# EAGLE design luxeon_r2 (EAGLE 5.08)
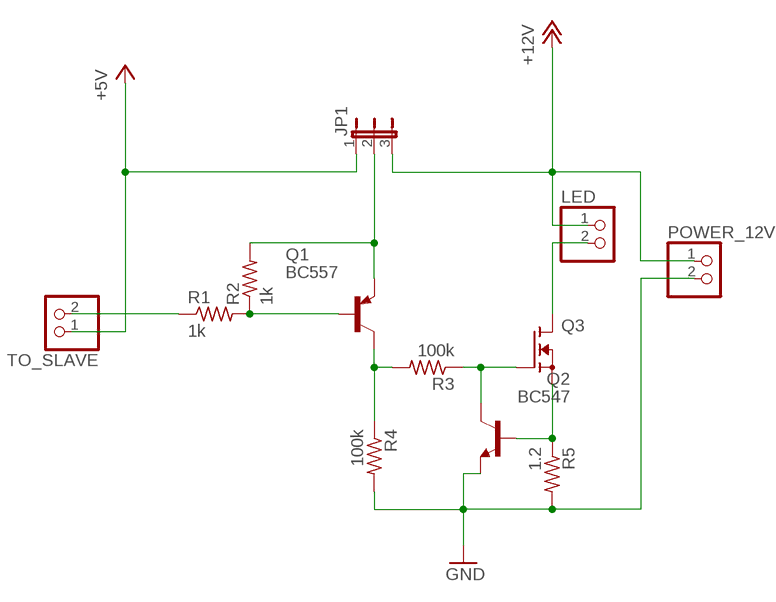
[diagram p0: schematic, sheet 1]

## Parts
JP1  JP2E  [JP2]
LED  PINHD-1X2  [1X02]
POWER_12V  PINHD-1X2  [1X02]
Q1  BC557  [TO92]
Q2  BC547  [TO92]
Q3  TOSHIBA-2SK4033  [TO252]
R1  1k  R-US_0204/5  [0204/5]
R2  1k  R-US_0204/5  [0204/5]
R3  100k  R-US_0204/5  [0204/5]
R4  100k  R-US_0204/5  [0204/5]
R5  1.2  R-US_0204/5  [0204/5]
TO_SLAVE  PINHD-1X2  [1X02]

## Nets
+5V: JP1.1 TO_SLAVE.1
+12V: JP1.3 LED.1 POWER_12V.1
DISSIPATE: LED.2 Q3.3(D)
GND: POWER_12V.2 Q2.1(E) R4.2 R5.2
N$1: Q1.2(B) R1.2 R2.1
N$2: Q2.3(C) Q3.1(G) R3.1
N$3: Q1.3(C) R3.2 R4.1
N$4: Q2.2(B) Q3.2(S) R5.1
N$5: JP1.2 Q1.1(E) R2.2
SLV: R1.1 TO_SLAVE.2

## Library data of the parts
JP1 = jumper:JP2E: JUMPER
LED POWER_12V TO_SLAVE = pinhead:PINHD-1X2: PIN HEADER
Q1 = transistor-pnp:BC557: PNP Transistor
Q2 = transistor:BC547: NPN TRANSISTOR
Q3 = damians_bits:TOSHIBA-2SK4033: TOSHIBA 2SK4033 Field Effect Transistor N-Channel MOSFET
R1-R5 = rcl:R-US_: RESISTOR, American symbol

## Board
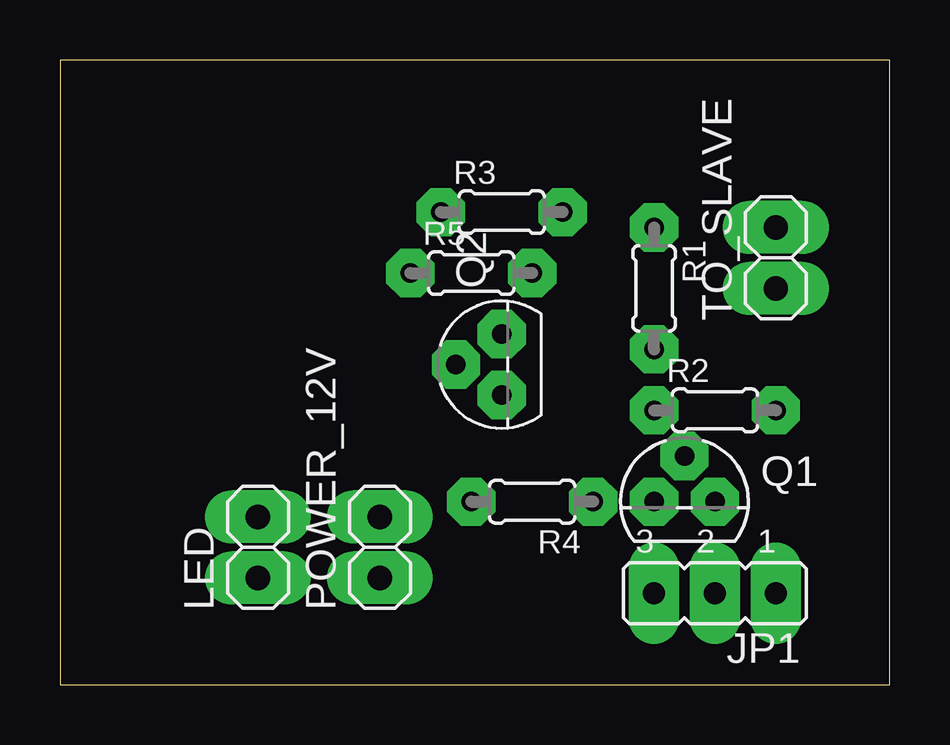
[diagram p1: board, top side]
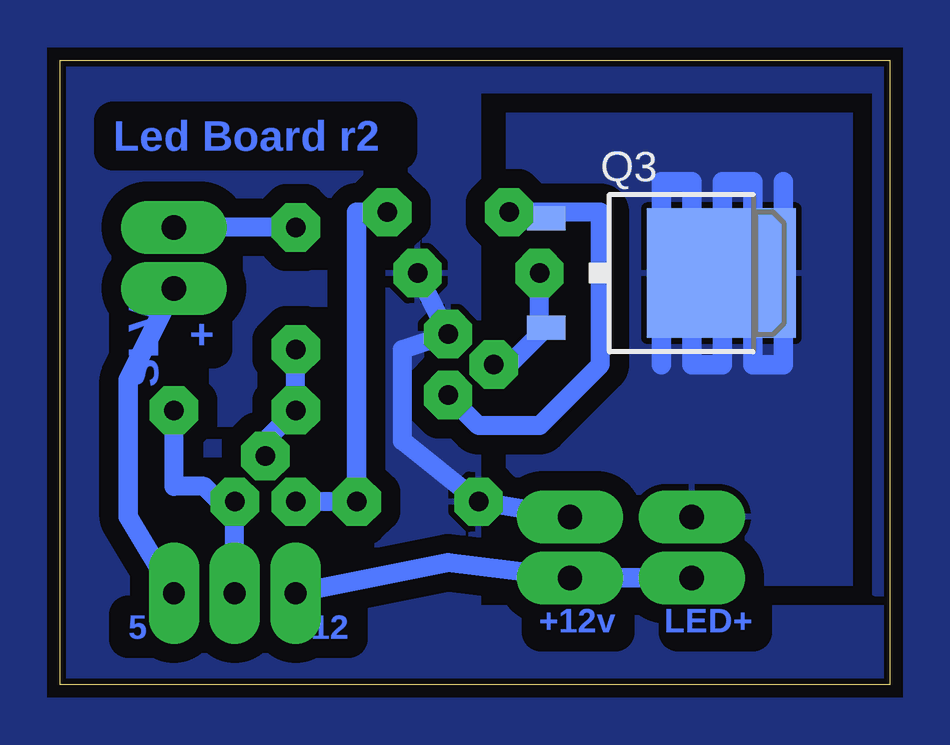
[diagram p2: board, bottom side, seen from below]

Size 34.59 x 26.03 mm. Coordinates in mm from the lower left corner, seen from the top.
Outline: 0,0 34.59,0 34.59,26.03 0,26.03 0,0
Copper layers (1*16): Top 0.035mm / dielectric 1.5mm / Bottom 0.035mm
Design rules "default": minimum track width 0.8mm, minimum drill 0.8mm, track to track 0.8mm, track to pad 0.8mm, pad to pad 0.45mm, via to via 0.8mm, smd to smd 8mil, copper to edge 10mil, drill to drill 8mil, minimum pad ring 0.6mm, minimum via ring 0.6mm, stop-mask expansion 0mil, vias tented up to drill 0mil, thermal gap 10mil

### Footprints (pad centres in the part's own frame; a part is rotated, then mirrored left to right if it is on the bottom)
JP2 = drill 0.914 long: 1 -2.54,0; 2 0,0; 3 2.54,0
1X02 = drill 1.016 long: 1 -1.27,0; 2 1.27,0
TO92 = drill 0.813 octagon: 1 1.27,0; 2 0,1.905; 3 -1.27,0
TO252 = smd 1 x 1.6: 1 -2.28,-4.8; 2 2.28,-4.8 | smd 5.4 x 6.2: 3 0,2.5
0204/5 = drill 0.813 octagon: 1 -2.54,0; 2 2.54,0

### Placement (x,y rotation side)
JP1  27.3,3.81 180 top
LED  8.26,5.71 90 top
POWER_12V  13.34,5.71 90 top
Q1  26.04,7.62 0 top
Q2  18.41,13.33 90 top
Q3  9.53,17.15 270 bottom
R1  24.77,16.51 270 top
R2  27.3,11.43 0 top
R3  18.41,19.69 0 top
R4  19.68,7.62 180 top
R5  17.14,17.15 0 top
TO_SLAVE  29.84,17.78 90 top

### Tracks (layer width: path | path; a pad name or v marks a point on that pad's centre or on a via)
+5V
  Bottom 0.813: TO_SLAVE.1 31.75,12.7 31.75,6.98 JP1.1
+12V
  Bottom 0.8: POWER_12V.1 18.41,5.08 JP1.3
  Bottom 0.813: LED.1 POWER_12V.1
DISSIPATE
  Bottom 0.813: 4.45,20.96 4.45,13.33 5.71,13.33 5.71,20.96 6.99,20.96 6.99,13.33 8.26,13.33 8.26,20.96 9.53,20.96 9.53,13.33
  pour Bottom (isolate 0.254, rank 2): 15.88,24.77 0.64,24.77 0.64,3.17 15.88,3.17
GND
  Bottom 0.8: POWER_12V.2 R4.2 20.32,10.16 20.32,13.97 Q2.1 R5.2
  pour Bottom: 34.92,26.04 34.92,0 0,0 0,3.17 17.14,3.17 17.14,24.77 0.64,24.77 0.64,3.81 0,3.81 0,26.04
N$1
  Bottom 0.8: Q1.2 26.04,10.16 R2.1 R1.2
N$2
  Bottom 0.8: 14.61,19.69 R3.1 | Q2.3 17.14,10.79 14.61,10.79 12.06,13.33 12.06,19.69 14.61,19.69 | 14.61,19.69 Q3.1
N$3
  Bottom 0.8: R4.1 Q1.3
  Bottom 0.813: R3.2 22.23,19.69 R4.1
N$4
  Bottom 0.8: 14.61,14.61 R5.1 | 14.61,14.61 15.88,13.33 Q2.2 | Q3.2 14.61,14.61
N$5
  Bottom 0.8: JP1.2 27.3,6.98 | 27.3,6.98 28.57,8.26 29.84,8.26 R2.2 | 27.3,6.98 Q1.1
S$1
  pour Bottom (rank 3): -10.16,40 48.26,40 48.26,-15.88 -10.16,-15.88
SLV
  Bottom 0.8: R1.1 TO_SLAVE.2

### Text on the board
Bottom: Led Board r2 | SLV | + | LED+ | +12v | 12 | 5